# EAGLE design TM8_flash (EAGLE 9.6.2)
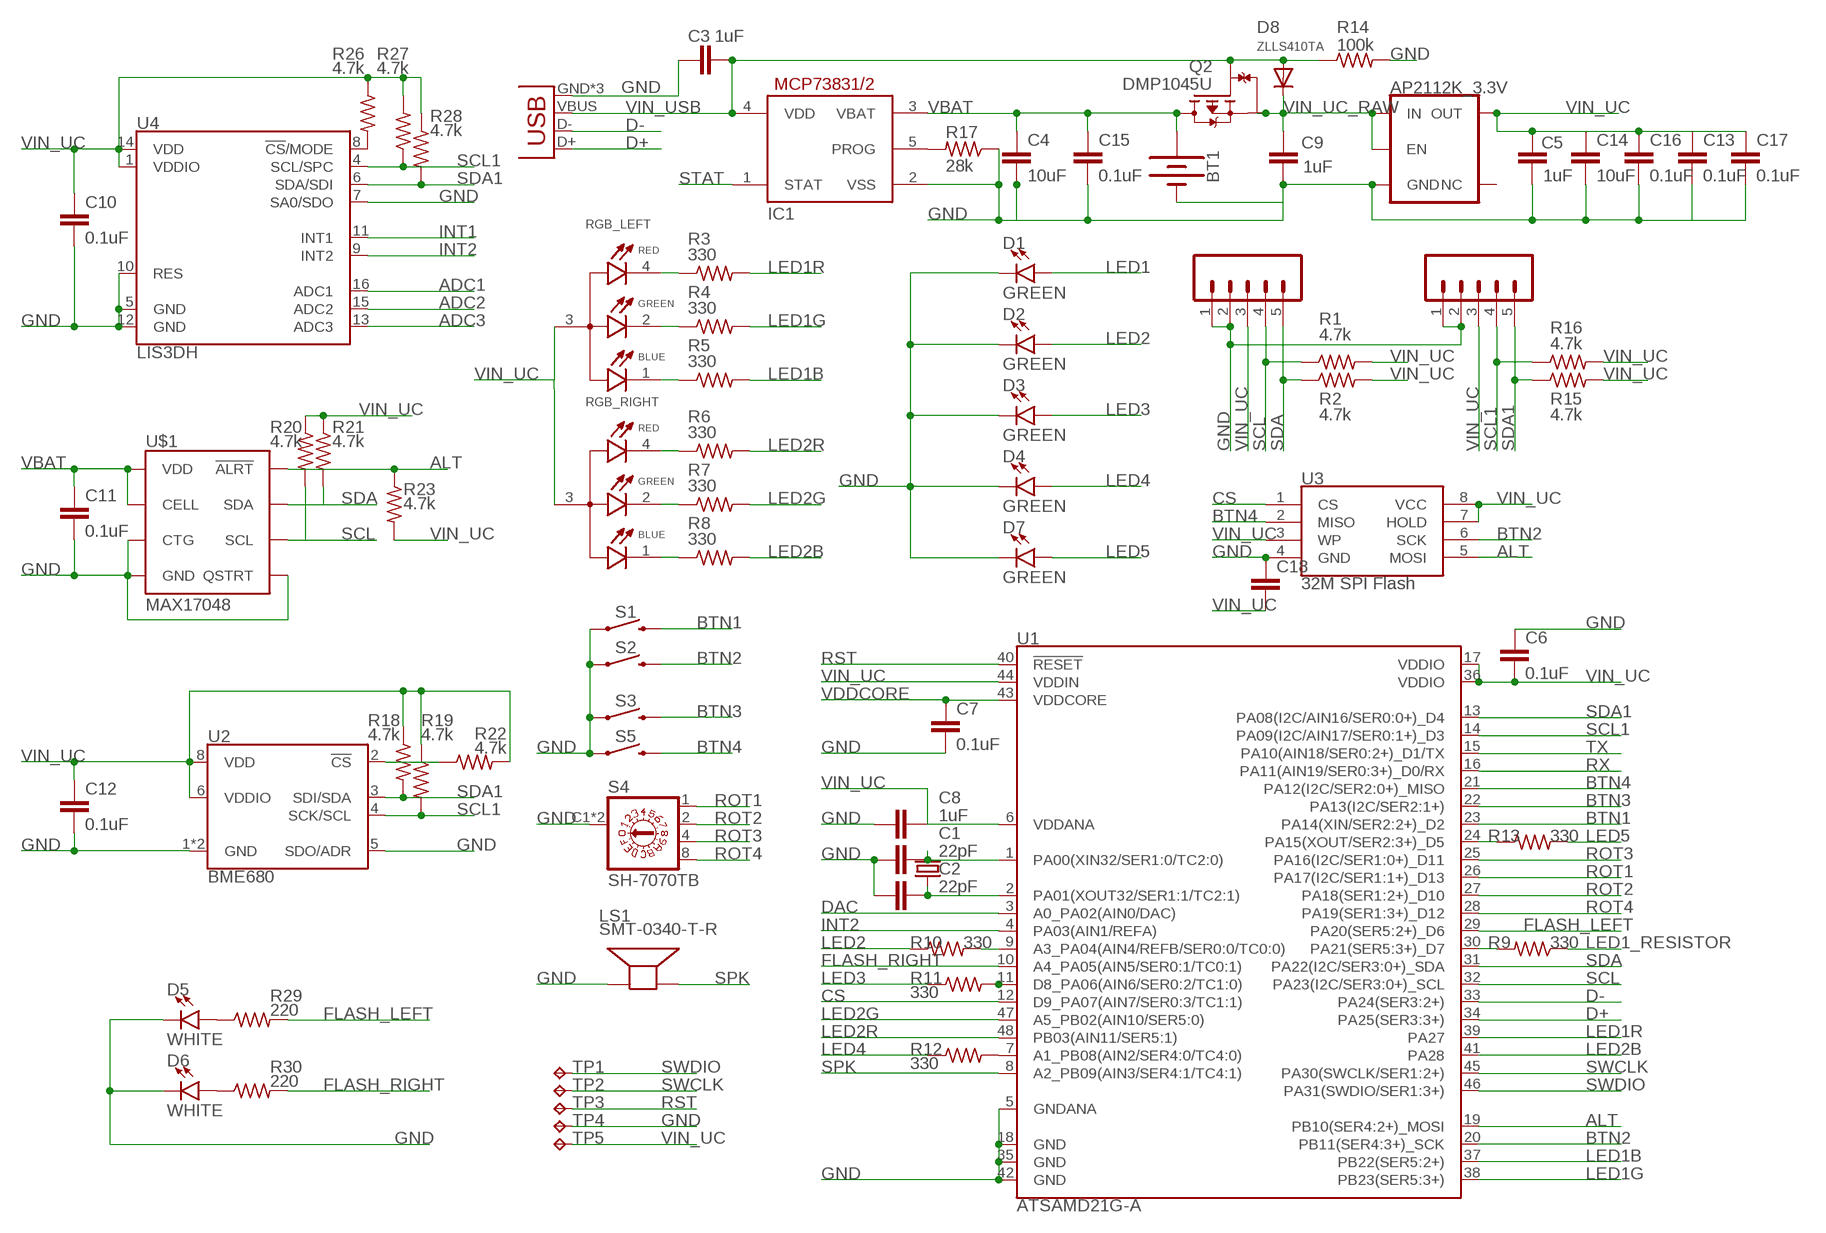
[diagram p0: schematic, sheet 1]

## Parts
AP2112K_3.3V  3.3V  V_REG_AP2112K-3.3V  [SOT23-5]
BT1  BATTERY-20MM_SMD_4LEGS_OVERPASTE_INNER  [BATTCON_20MM_4LEGS_OVERPASTE_INNER]
C1  22pF  C-EUC0402  [C0402]
C2  22pF  C-EUC0402  [C0402]
C3  1uF  C-EUC0402  [C0402]
C4  10uF  C-EUC0402  [C0402]
C5  1uF  C-EUC0402  [C0402]
C6  0.1uF  C-EUC0402  [C0402]
C7  0.1uF  C-EUC0402  [C0402]
C8  1uF  C-EUC0402  [C0402]
C9  1uF  C-EUC0402  [C0402]
C10  0.1uF  C-EUC0402  [C0402]
C11  0.1uF  C-EUC0402  [C0402]
C12  0.1uF  C-EUC0402  [C0402]
C13  0.1uF  C-EUC0402  [C0402]
C14  10uF  C-EUC0402  [C0402]
C15  0.1uF  C-EUC0402  [C0402]
C16  0.1uF  C-EUC0402  [C0402]
C17  0.1uF  C-EUC0402  [C0402]
C18  C-EUC0402  [C0402]
D1  GREEN  LED-GREEN1206  [LED-1206]
D2  GREEN  LED-GREEN1206  [LED-1206]
D3  GREEN  LED-GREEN1206  [LED-1206]
D4  GREEN  LED-GREEN1206  [LED-1206]
D5  WHITE  LED-WHITE1206  [LED-1206]
D6  WHITE  LED-WHITE1206  [LED-1206]
D7  GREEN  LED-GREEN1206  [LED-1206]
D8  ZLLS410TA  DIODESOD-323F  [SOD-323F]
IC1  MCP73831/OT  [SOT23-5L]
JP2  USB-MICROB  [USB-MICROB]
LCD1  CONN_05VERT_FEMALE_HEADER  [1X05_SMD_VERTICAL_COMBO]
LCD2  CONN_05VERT_FEMALE_HEADER  [1X05_SMD_VERTICAL_COMBO]
LS1  SMT-0340-T-R  [XDCR_SMT-0340-T-R]
Q2  DMP1045U  [SOT91P240X110-3N]
R1  4.7k  R-US_R0402  [R0402]
R2  4.7k  R-US_R0402  [R0402]
R3  330  R-US_R0402  [R0402]
R4  330  R-US_R0402  [R0402]
R5  330  R-US_R0402  [R0402]
R6  330  R-US_R0402  [R0402]
R7  330  R-US_R0402  [R0402]
R8  330  R-US_R0402  [R0402]
R9  330  R-US_R0402  [R0402]
R10  330  R-US_R0402  [R0402]
R11  330  R-US_R0402  [R0402]
R12  330  R-US_R0402  [R0402]
R13  330  R-US_R0402  [R0402]
R14  100k  R-US_R0402  [R0402]
R15  4.7k  R-US_R0402  [R0402]
R16  4.7k  R-US_R0402  [R0402]
R17  28k  R-US_R0402  [R0402]
R18  4.7k  R-US_R0402  [R0402]
R19  4.7k  R-US_R0402  [R0402]
R20  4.7k  R-US_R0402  [R0402]
R21  4.7k  R-US_R0402  [R0402]
R22  4.7k  R-US_R0402  [R0402]
R23  4.7k  R-US_R0402  [R0402]
R26  4.7k  R-US_R0402  [R0402]
R27  4.7k  R-US_R0402  [R0402]
R28  4.7k  R-US_R0402  [R0402]
R29  220  R-US_R0402  [R0402]
R30  220  R-US_R0402  [R0402]
RGB_LEFT  EAST1616RGBA3  [LED_EAST1616RGBA3]
RGB_RIGHT  EAST1616RGBA3  [LED_EAST1616RGBA3]
S1  MOMENTARY-SWITCH-SPST-SMD-6.0X3.5MM  [TACTILE_SWITCH_SMD_6.0X3.5MM]
S2  MOMENTARY-SWITCH-SPST-SMD-6.0X3.5MM  [TACTILE_SWITCH_SMD_6.0X3.5MM]
S3  MOMENTARY-SWITCH-SPST-SMD-6.0X3.5MM  [TACTILE_SWITCH_SMD_6.0X3.5MM]
S4  SH-7070TB  [SH-7070B]
S5  MOMENTARY-SWITCH-SPST-SMD-6.0X3.5MM  [TACTILE_SWITCH_SMD_6.0X3.5MM]
TP1  TPTP14R  [TP14R]
TP2  TPTP14R  [TP14R]
TP3  TPTP11R  [TP11R]
TP4  TPTP14R  [TP14R]
TP5  TPTP14R  [TP14R]
U1  ATSAMD21G-A  [TQFP-48]
U2  BME680  BME680-LGA  [LGA3.0X3.0]
U3  32M SPI Flash  SPI_FLASH-X25XXSMD  [SO08]
U4  LIS3DH  [LGA-16-3X3]
U$1  MAX17048  MAX17048DFN8  [DFN-8]
Y1  32.768kHz  CRYSTAL-32.768KHZSMD-3.2X1.5  [CRYSTAL-SMD-3.2X1.5MM]

## Nets
ADC1: U4.16(ADC1)
ADC2: U4.15(ADC2)
ADC3: U4.13(ADC3)
ALT: R23.1 U1.19(PB10(SER4:2+)_MOSI) U3.5(MOSI) U$1.P$5(!ALRT)
BTN1: S1.2 U1.23(PA14(XIN/SER2:2+)_D2)
BTN2: S2.2 U1.20(PB11(SER4:3+)_SCK) U3.6(SCK)
BTN3: S3.2 U1.22(PA13(I2C/SER2:1+))
BTN4: S5.2 U1.21(PA12(I2C/SER2:0+)_MISO) U3.2(MISO)
CS: U1.12(D9_PA07(AIN7/SER0:3/TC1:1)) U3.1(CS)
D+: JP2.D+ U1.34(PA25(SER3:3+))
D-: JP2.D- U1.33(PA24(SER3:2+))
DAC: U1.3(A0_PA02(AIN0/DAC))
FLASH_LEFT: R29.2 U1.29(PA20(SER5:2+)_D6)
FLASH_RIGHT: R30.2 U1.10(A4_PA05(AIN5/SER0:1/TC0:1))
GND: AP2112K_3.3V.2(GND) BT1.2(-) C1.1 C2.1 C3.1 C4.2 C5.2 C6.1 C7.2 C8.1 C9.2 C10.2 C11.2 C12.2 C13.2 C14.2 C15.2 C16.2 C17.2 C18.1 D1.C D2.C D3.C D4.C D5.C D6.C D7.C IC1.2(VSS) JP2.GND JP2.MT1(GND) JP2.MT2(GND) LCD1.1 LCD1.2 LCD2.1 LCD2.2 LS1.P R14.2 R17.1 S1.1 S2.1 S3.1 S4.C1(C) S4.C2(C) S5.1 TP4.TP U1.5(GNDANA) U1.18(GND) U1.35(GND) U1.42(GND) U2.1(GND) U2.5(SDO/ADR) U2.7(GND) U3.4(GND) U4.5(GND) U4.7(SA0/SDO) U4.10(RES) U4.12(GND) U$1.P$1(CTG) U$1.P$4(GND) U$1.P$6(QSTRT) U$1.P$9(GND)
INT1: U4.11(INT1)
INT2: U1.4(PA03(AIN1/REFA)) U4.9(INT2)
LED1: D1.A
LED1_RESISTOR: R9.1
LED1B: R5.2 U1.37(PB22(SER5:2+))
LED1G: R4.2 U1.38(PB23(SER5:3+))
LED1R: R3.2 U1.39(PA27)
LED2: D2.A R10.1
LED2B: R8.2 U1.41(PA28)
LED2G: R7.2 U1.47(A5_PB02(AIN10/SER5:0))
LED2R: R6.2 U1.48(PB03(AIN11/SER5:1))
LED3: D3.A R11.1
LED4: D4.A R12.1
LED5: D7.A R13.2
N$1: R12.2 U1.7(A1_PB08(AIN2/SER4:0/TC4:0))
N$2: R11.2 U1.11(D8_PA06(AIN6/SER0:2/TC1:0))
N$3: R9.2 U1.30(PA21(SER5:3+)_D7)
N$4: R10.2 U1.9(A3_PA04(AIN4/REFB/SER0:0/TC0:0))
N$5: R3.1 RGB_LEFT.4(R_C)
N$6: R4.1 RGB_LEFT.2(G_C)
N$7: R5.1 RGB_LEFT.1(B_C)
N$8: R6.1 RGB_RIGHT.4(R_C)
N$9: R7.1 RGB_RIGHT.2(G_C)
N$10: R8.1 RGB_RIGHT.1(B_C)
N$11: R13.1 U1.24(PA15(XOUT/SER2:3+)_D5)
N$13: IC1.5(PROG) R17.2
N$15: R22.1 U2.2(!CS)
N$16: D5.A R29.1
N$17: R26.2 U4.8(!CS!/MODE)
N$18: D6.A R30.1
ROT1: S4.1 U1.26(PA17(I2C/SER1:1+)_D13)
ROT2: S4.2 U1.27(PA18(SER1:2+)_D10)
ROT3: S4.4 U1.25(PA16(I2C/SER1:0+)_D11)
ROT4: S4.8 U1.28(PA19(SER1:3+)_D12)
RST: TP3.TP U1.40(!RESET!)
RX: U1.16(PA11(AIN19/SER0:3+)_D0/RX)
SCL: LCD1.4 R1.1 R20.2 U1.32(PA23(I2C/SER3:0+)_SCL) U$1.P$7(SCL)
SCL1: LCD2.4 R16.1 R19.2 R27.1 U1.14(PA09(I2C/AIN17/SER0:1+)_D3) U2.4(SCK/SCL) U4.4(SCL/SPC)
SDA: LCD1.5 R2.1 R21.2 U1.31(PA22(I2C/SER3:0+)_SDA) U$1.P$8(SDA)
SDA1: LCD2.5 R15.1 R18.2 R28.2 U1.13(PA08(I2C/AIN16/SER0:0+)_D4) U2.3(SDI/SDA) U4.6(SDA/SDI)
SPK: LS1.N U1.8(A2_PB09(AIN3/SER4:1/TC4:1))
STAT: IC1.1(STAT)
SWCLK: TP2.TP U1.45(PA30(SWCLK/SER1:2+))
SWDIO: TP1.TP U1.46(PA31(SWDIO/SER1:3+))
TX: U1.15(PA10(AIN18/SER0:2+)_D1/TX)
VBAT: BT1.1(+) C4.1 C11.1 C15.1 IC1.3(VBAT) Q2.3(D) U$1.P$2(CELL) U$1.P$3(VDD)
VDDCORE: C7.1 U1.43(VDDCORE)
VIN_UC: AP2112K_3.3V.5(OUT) C5.1 C6.2 C8.2 C10.1 C12.1 C13.1 C14.1 C16.1 C17.1 C18.2 LCD1.3 LCD2.3 R1.2 R2.2 R15.2 R16.2 R18.1 R19.1 R20.1 R21.1 R22.2 R23.2 R26.1 R27.2 R28.1 RGB_LEFT.3(A) RGB_RIGHT.3(A) TP5.TP U1.6(VDDANA) U1.17(VDDIO) U1.36(VDDIO) U1.44(VDDIN) U2.6(VDDIO) U2.8(VDD) U3.3(WP) U3.7(HOLD) U3.8(VCC) U4.1(VDDIO) U4.14(VDD)
VIN_UC_RAW: AP2112K_3.3V.1(IN) AP2112K_3.3V.3(EN) C9.1 D8.C Q2.2(S)
VIN_USB: C3.2 D8.A IC1.4(VDD) JP2.VBUS Q2.1(G) R14.1
XIN32: C1.2 U1.1(PA00(XIN32/SER1:0/TC2:0)) Y1.P$2
XOUT32: C2.2 U1.2(PA01(XOUT32/SER1:1/TC2:1)) Y1.P$1
Unconnected: AP2112K_3.3V.4(NC)

## Notes on the sheet
- D8 | R14
- C3
- R26 | R27
- R28
- C9 | C5
- R20 | R21
- R23
- R18 | R19
- R22
- R13
- R10 | R9
- R11
- R29
- R12
- R30

## Library data of the parts
AP2112K_3.3V = SparkFun-IC-Power:V_REG_AP2112: AP2112 - 600mA CMOS LDO Regulator w/ Enable The AP2112 is CMOS process low dropout linear regulator with enable function, the regulator delivers a guaranteed 600mA (min.) continuous load current. Features Output Voltage Accuracy: ±1.5% Output Current: 600mA (Min.) Foldback Short Current Protection: 50mA Enable Function to Turn ON/OFF VOUT Low Dropout Voltage (3.3V): 250mV (Typ.) @IOUT=600mA Excellent Load Regulation: 0.2%/A (Typ.) Excellent Line Regulation: 0.02%/V (Typ.) Low Quiescent Current: 55μA (Typ.) Low Standby Current: 0.01μA (Typ.) Low Output Noise: 50μVRMS PSRR: 100Hz -65dB, 1kHz -65dB OTSD Protection Stable with 1.0μF Flexible Cap: Ceramic, Tantalum and Aluminum Electrolytic Operation Temperature Range: -40°C to 85°C ESD: MM 400V, HBM 4000V; PROD_ID: VREG-12457
BT1 = SparkFun-Batteries:BATTERY: Battery - Single Cell A variety of battery chemistries, sizes, and footprints. Device List: 20MM_PTH - Coin Cell Battery Holder - 20mm (PTH) <https://www.sparkfun.com/products/783> 20MM_PTH_KIT- Coin Cell battery Holder - 20 mm (PTH) <http://www.sparkfun.com/products/783>kit version with special mask 6.8MM_PTH - Coin Cell Battery Holder - 6.8MM(SMD) <https://www.digikey.com/product-detail/en/seiko-instruments/MS621FE-FL11E/728-1057-ND/1889208?WT.srch=1&gclid=CNOQ5a6LzdQCFZS2wAodXCkE0g> 12MM_SMD - Coin Cell Battery Holder - 12mm (SMD) <https://www.sparkfun.com/products/10592> 12MM_PTH - Coin Cell Battery Holder - 12mm (PTH) <https://www.sparkfun.com/products/7948> 20MM_SMD - 20mm Coin Cell Battery Holder (SMD) (2 legs) Used on the Big Time Watch Kit <https://www.sparkfun.com/products/11734> 20MM_SMD_4LEGS - Coin Cell Battery Holder - 20mm (SMD) <https://www.sparkfun.com/products/11892> 20MM_SMD_4LEGS_OVERPASTE - Coin Cell Battery Holder - 20mm (SMD) <https://www.sparkfun.com/products/11892> (Over-paste on the legs) 24.5MM_PTH - Coin Cell Battery Holder - 24.5mm (PTH) <https://www.sparkfun.com/products/8863> 9V - 9V Battery Holder - PC Mount Used on the SparkFun SparkPunk Sound Kit <https://www.sparkfun.com/products/11177> and SparkFun SparkPunk Sequencer Kit <https://www.sparkfun.com/products/12707> 18650 - Battery Holder - 18650 (PTH) <https://www.sparkfun.com/products/13113> AA - Battery Holder - 1xAA (PTH) <https://www.sparkfun.com/products/7949> AAA - Battery Holder - 1xAAA (PTH) <https://www.sparkfun.com/products/12718> AA_KIT - Battery Holder - 1xAA (PTH) <https://www.sparkfun.com/products/7949> Special kit package - pads only have exposed copper on one side of the board. AAA_KIT - Battery Holder - 1xAAA (PTH) <https://www.sparkfun.com/products/12718> Special kit package - pads only have exposed copper on one side of the board.
C1-C18 = rcl:C-EU: CAPACITOR, European symbol; SPICEPREFIX: C
D1-D4 D7 = SparkFun-LED:LED-GREEN: Green SMD LED Used in manufacturing of various products at SparkFun Packages: 0603 - SMD 0603 package [Product Link] <http://www.futureelectronics.com/en/technologies/semiconductors/optoelectronics/leds/Pages/9894312-LTST-C190GKT.aspx?CrossPart=HSMG-C190&IM=0> LilyPad 1206 - SMD1206 LilyPad package [Product Link] <http://www.futureelectronics.com/en/Technologies/Product.aspx?ProductID=IN150NGHARVATEKCORPORATION2049943&IM=0> 1206 - SMD1206 package [Product Link] <http://www.futureelectronics.com/en/technologies/semiconductors/optoelectronics/leds/Pages/8315665-LTST-C150KGKT.aspx?IM=0> 1206 Bottom Mount -SMD 1206 Bottom Mount [Product Link] <http://www.digikey.com/product-detail/en/lite-on-inc/LTST-C230KGKT/160-1456-1-ND/386854> SparkFun Products: Pro Mini 328 -5V <https://www.sparkfun.com/products/821> RedBoard <https://www.sparkfun.com/products/12757> MP3 Trigger <https://www.sparkfun.com/products/13720> Makey Makey <https://www.sparkfun.com/products/11076>; PROD_ID: DIO-00862
D5 D6 = SparkFun-LED:LED-WHITE: White SMD LED Used in manufacturing several products at SparkFun. Packages: 0603 - Bright White SMD 0603 package[Product Link] <http://www.kingbrightusa.com/product.asp?catalog_name=LED&product_id=APT1608QWF/D> 1206 - Bright White SMD1206 package [Product Link] <http://www.kingbrightusa.com/product.asp?catalog_name=LED&product_id=APT3216QWF/D> 3014 - Super Bright SMD 3014 package [Datasheet] <http://www.lumileds.com/uploads/459/DS208-pdf> SparkFun Products: Blackberry Trackballer Breakout <https://www.sparkfun.com/products/13169> Digital SandBox <https://www.sparkfun.com/products/12651>; PROD_ID: DIO-09955
D8 = adafruit:DIODE: Diode SMADIODE - SMA Surface Mount Package 20V 1A Schottky Diode Digikey: 641-1014-6-ND DO-1N4148 - Through Hole Small Current Diode SOD-123 20V 1 A (.5mV Vf) Schottky Diode - Digikey: MBRX120TPMSCT-ND SOD-323 10V 570mA (.38mV Vf, 3ns) Schottky Diode - Digikey: ZLLS410CT-ND SOD-523 30V 30mA Schottky Diode (RB751S-40TE61) - Digikey: RB751S-40TE61CT-ND SOT23-R/W - SOT23 Package (R = Solder Paste/Reflow Ovens, W = Hand-Soldering) BAT54Film 40V 300mA - Digikey: 497-7162-1-ND
IC1 = adafruit:MCP73831: MCP73831/2 Miniature Single-Cell, Fully Integrated Li-Ion, Li-Polymer Charge Management Controllers. Nice and small simple lipoly charge controller, with adjustable current and status output (LED) http://www.ladyada.net/library/pcb/eaglelibrary.html
JP2 = Feesta-parts:USB: USB Connectors USB-B-PTH is fully proven SKU : PRT-00139/CONN-08278 USB-miniB is fully proven SKU : PRT-00587 USB-A-PCB is untested. USB-A-H is throughly reviewed, but untested. Spark Fun Electronics SKU : PRT-00437 USB-B-SMT is throughly reviewed, but untested. Needs silkscreen touching up. USB-A-S has not been used/tested USB-MB-H has not been used/tested USB-MICROB has been used. CONN-09505; PROD_ID: CONN-09505
LCD1 LCD2 = SparkFun-Connectors:CONN_05: Multi connection point. Often used as Generic Header-pin footprint for 0.1 inch spaced/style header connections On any of the 0.1 inch spaced packages, you can populate with these: Break Away Headers - Straight <https://www.sparkfun.com/products/116> (PRT-00116) Break Away Male Headers - Right Angle <https://www.sparkfun.com/products/553> (PRT-00553) Female Headers <https://www.sparkfun.com/products/115> (PRT-00115) Break Away Headers - Machine Pin <https://www.sparkfun.com/products/117> (PRT-00117) Break Away Female Headers - Swiss Machine Pin <https://www.sparkfun.com/products/743> (PRT-00743) For SCREWTERMINALS and SPRING TERMINALS visit here: Screw Terimnals on SparkFun.com <https://www.sparkfun.com/search/results?term=Screw+Terminals> (5mm/3.5mm/2.54mm spacing) This device is also useful as a general connection point to wire up your design to another part of your project. Our various solder wires solder well into these plated through hole pads. Hook-Up Wire - Assortment (Stranded, 22 AWG) <https://www.sparkfun.com/products/11375> (PRT-11375) Hook-Up Wire - Assortment (Solid Core, 22 AWG) <https://www.sparkfun.com/products/11367> (PRT-11367) View the entire wire category on our website here <https://www.sparkfun.com/categories/141> Special notes: Molex polarized connector foot print use with SKU : PRT-08231 with associated crimp pins and housings. 1MM SMD Version SKU: PRT-10208; PROD_ID: CONN-15262
LS1 = SMT-0340-T-R:SMT-0340-T-R; MANUFACTURER: Pui Audio; MAXIMUM_PACKAGE_HEIGHT: 2.00 mm; PARTREV: 3/10/2020; STANDARD: Manufacturer Recomemndations
Q2 = DMP1045U:DMP1045U: P-Channel 12V 4A (Ta) 800mW (Ta) Surface Mount SOT-23 Check availability <https://pricing.snapeda.com/parts/DMP1045U/Diodes%20Inc./view-part?ref=eda>; AVAILABILITY: In Stock; DESCRIPTION: P-Channel 12 V 2.6A (Ta) 530mW Surface Mount X2-WLB0808-4 (Type C); MF: Diodes Inc.; MP: DMP1045U; PACKAGE: SOT-23 Diodes Inc.; PRICE: None; PURCHASE-URL: https://pricing.snapeda.com/search/part/DMP1045U/?ref=eda
R1-R13 R15 R16 R18-R23 R26-R30 = rcl:R-US_: RESISTOR, American symbol; SPICEPREFIX: R
R14 R17 = adafruit:R-US_: RESISTOR, American symbol
RGB_LEFT RGB_RIGHT = EAST1616RGBA3:EAST1616RGBA3: Red, Green, Blue (RGB) LED Indication - Discrete 1.95V Red, 2.8V Green, 2.8V Blue 0606 (1616 Metric) Check availability <https://pricing.snapeda.com/parts/EAST1616RGBA3/Everlight%20Electronics/view-part?ref=eda>; AVAILABILITY: In Stock; DESCRIPTION: Red, Green, Blue (RGB) - LED Indication - Discrete 1.95V Red, 2.8V Green, 2.8V Blue 0606 (1616 Metric); MF: Everlight Electronics; MP: EAST1616RGBA3; PACKAGE: 0606 Everlight; PRICE: None; PURCHASE-URL: https://pricing.snapeda.com/search/part/EAST1616RGBA3/?ref=eda
S1-S3 S5 = SparkFun-Switches:MOMENTARY-SWITCH-SPST: Momentary Switch (Pushbutton) - SPST Normally-open (NO) SPST momentary switches (buttons, pushbuttons). Variants PTH-12MM - 12mm square, through-hole Momentary Pushbutton Switch - 12mm Square <https://www.sparkfun.com/products/9190> (COM-09190) PTH-6.0MM, PTH-6.0MM-KIT - 6.0mm square, through-hole Mini Pushbutton Switch <https://www.sparkfun.com/products/97> (COM-00097) KIT package intended for soldering kit's - only one side of pads' copper is exposed. PTH-RIGHT-ANGLE-KIT - Right-angle, through-hole Right Angle Tactile Button <https://www.sparkfun.com/products/10791> - Used on SparkFun BigTime Watch Kit <https://www.sparkfun.com/products/11734> SMD-12MM - 12mm square, surface-mount Tactile Button - SMD (12mm) <https://www.sparkfun.com/products/12993> (COM-12993) Used on SparkFun PicoBoard <https://www.sparkfun.com/products/11888> SMD-4.5MM - 4.5mm Square Trackball Switch Used on SparkFun Blackberry Trackballer Breakout <https://www.sparkfun.com/products/13169> SMD-4.6MMX2.8MM - 4.60mm x 2.80mm, surface mount Used on SparkFun Pro Micro - RP2040 <https://www.sparkfun.com/products/17717> SMD-5.2MM, SMD-5.2-REDUNDANT - 5.2mm square, surface-mount Mini Pushbutton Switch - SMD <https://www.sparkfun.com/products/8720> (COM-08720) Used on Arduino Pro Mini <https://www.sparkfun.com/products/11114> REDUNDANT package connects both switch circuits together SMD-6.0X3.5MM - 6.0 x 3.5mm, surface mount Momentary Reset Switch SMD <https://www.sparkfun.com/products/8229> (COM-08229) SMD-6.2MM-TALL - 6.2mm square, surface mount Tactile Button - SMD (6mm) <https://www.sparkfun.com/products/12992> Used on SparkFun Digital Sandbox <https://www.sparkfun.com/products/12651> SMD-RIGHT-ANGLE - Right-angle, surface mount Used on SparkFun Block for Intel® Edison - Arduino <https://www.sparkfun.com/products/13036>; PROD_ID: SWCH-14278; SF_SKU: COM-08229
S4 = SH-7070TB:SH-7070TB: ROTARY CODED HEX SWITCH Check availability <https://pricing.snapeda.com/parts/SH-7070TB/Nidec%20Copal/view-part?ref=eda>; AVAILABILITY: In Stock; DESCRIPTION: Dip Switch Hexadecimal Complement 16 Position Surface Mount Rotary for Tool Actuator 100mA 5VDC; MF: Nidec Copal; MP: SH-7070TB; PACKAGE: None; PRICE: None; PURCHASE-URL: https://pricing.snapeda.com/search/part/SH-7070TB/?ref=eda
TP1-TP5 = testpad:TP: Test pad
U1 = SparkFun-IC-Microcontroller:ATSAMD21G: Atmel SAMD21G SMART ARM-Based Microcontroller The Atmel ® | SMART ™ SAM D21 is a series of low-power microcontrollers using the 32-bit ARM ® Cortex ® -M0+ processor, and ranging from 32- to 64-pins with up to 256KB Flash and 32KB of SRAM. The SAM D21 devices operate at a maximum frequency of 48MHz and reach 2.46 CoreMark/MHz. They are designed for simple and intuitive migration with identical peripheral modules, hex compatible code, identical linear address map and pin compatible migration paths between all devices in the product series. All devices include intelligent and flexible peripherals, Atmel Event System for inter-peripheral signaling, and support for capacitive touch button, slider and wheel user interfaces. Datasheet <https://cdn.sparkfun.com/datasheets/Dev/Arduino/Boards/Atmel-42181-SAM-D21_Datasheet.pdf> SparkFun Products SparkFun SAMD21 Mini Breakout <https://www.sparkfun.com/products/13664> (DEV-13664) SparkFun SAMD21 Dev Breakout <https://www.sparkfun.com/products/13672> (DEV-13672) (DEV-14926); PROD_ID: IC-13064
U2 = SparkFun-Sensors:BME680: Bosch BME680 – Combined Humidity and Pressure Sensor The BME680 is as combined digital humidity, pressure and temperature sensor based on proven sensing principles. The sensor module is housed in an extremely compact metal-lid LGA package with a footprint of only 3.0×3.0mm with a height of 0.93mm. Its small dimensions and its low power consumption allow the implementation in battery driven devices such as handsets, GPS modules or watches.; PROD_ID: IC-14656
U3 = SparkFun-IC-Memory:SPI_FLASH-X25XX: 32M Serial Flash Memory 8pin SPI Flash series x25xx. Works with devices like W25X32 and BR25L32 Datasheet <http://www.macronix.com/Lists/Datasheet/Attachments/5031/MX25L3206E,%203V,%2032Mb,%20v1.5.pdf> SparkFun Products SparkFun Venus GPS Logger <https://www.sparkfun.com/products/10920> (GPS-10920); PROD_ID: N/A
U4 = SparkFun-Sensors:LIS3DH: ST Microelectronics LIS3DH 3-Axis ±2/4/8/16g SPI/I2C Accelerometer The LIS3DH is a three axis MEMS linear accelerometer in the "nano" family. It has a digital I2C/SPI serial interface which makes it ideal for using in embedded applications. The device also features ultra low-power operational modes that allow advanced power saving and smart sleep to wake-up functions, built in detections with interrupts, and auxiliary ADC inputs Datasheet-XXXX <http://www.sparkfun.com/datasheets/Sensors/Accelerometer/LIS3DH.pdf> SparkFun Products SparkFun Triple Axis Accelerometer Breakout - LIS3DH <https://www.sparkfun.com/products/10345> (SEN-XXXXX) Triple Axis Accelerometer - LIS3DH <https://www.sparkfun.com/products/9755> (SEN-XXXXX); PROD_ID: IC-13419; SF_ID: N/A
U$1 = SparkFun-IC-Power:MAX17048: Micropower 1-Cell Li+ ModelGauge SparkFun Products Qduino Mini <https://www.sparkfun.com/products/13614> (DEV-13614); PROD_ID: IC-12551
Y1 = SparkFun-Clocks:CRYSTAL-32.768KHZ: 32.768kHz Crystal Frequency: 32.768kHz Frequency Stability: ±20ppm Load Capacitance: 12.5pF (PTH-2X6 & SMD-3.2X1.5), 6pF (SMD-2X6) SparkFun Products: SparkFun BigTime Watch Kit <https://www.sparkfun.com/products/11734> SparkFun nRF52832 Breakout <https://www.sparkfun.com/products/13990> SparkFun Real Time Clock Module <https://www.sparkfun.com/products/12708>; PROD_ID: XTAL-13062

## Board
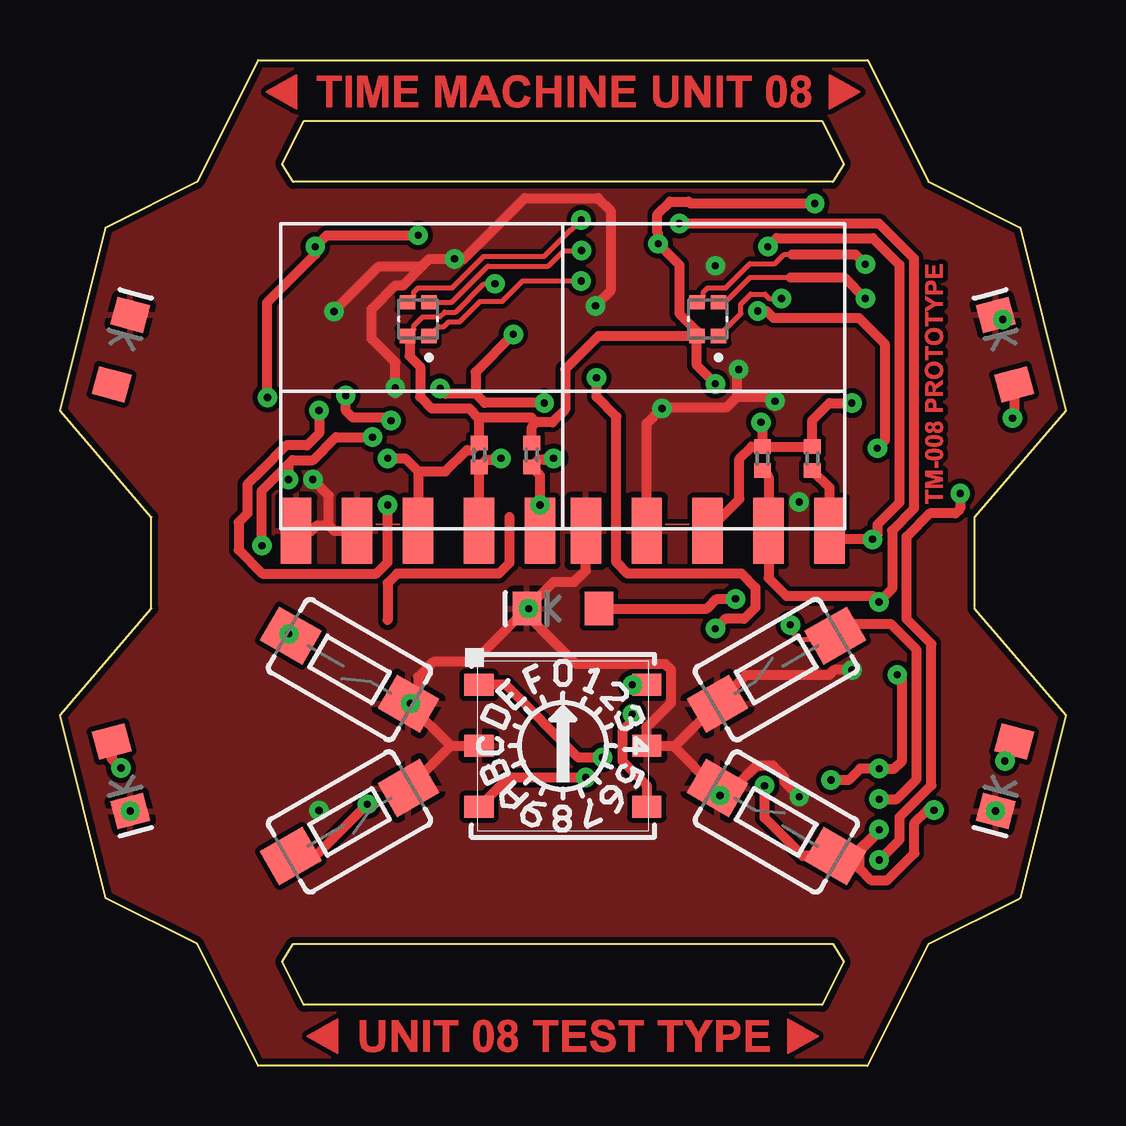
[diagram p1: board, top side]
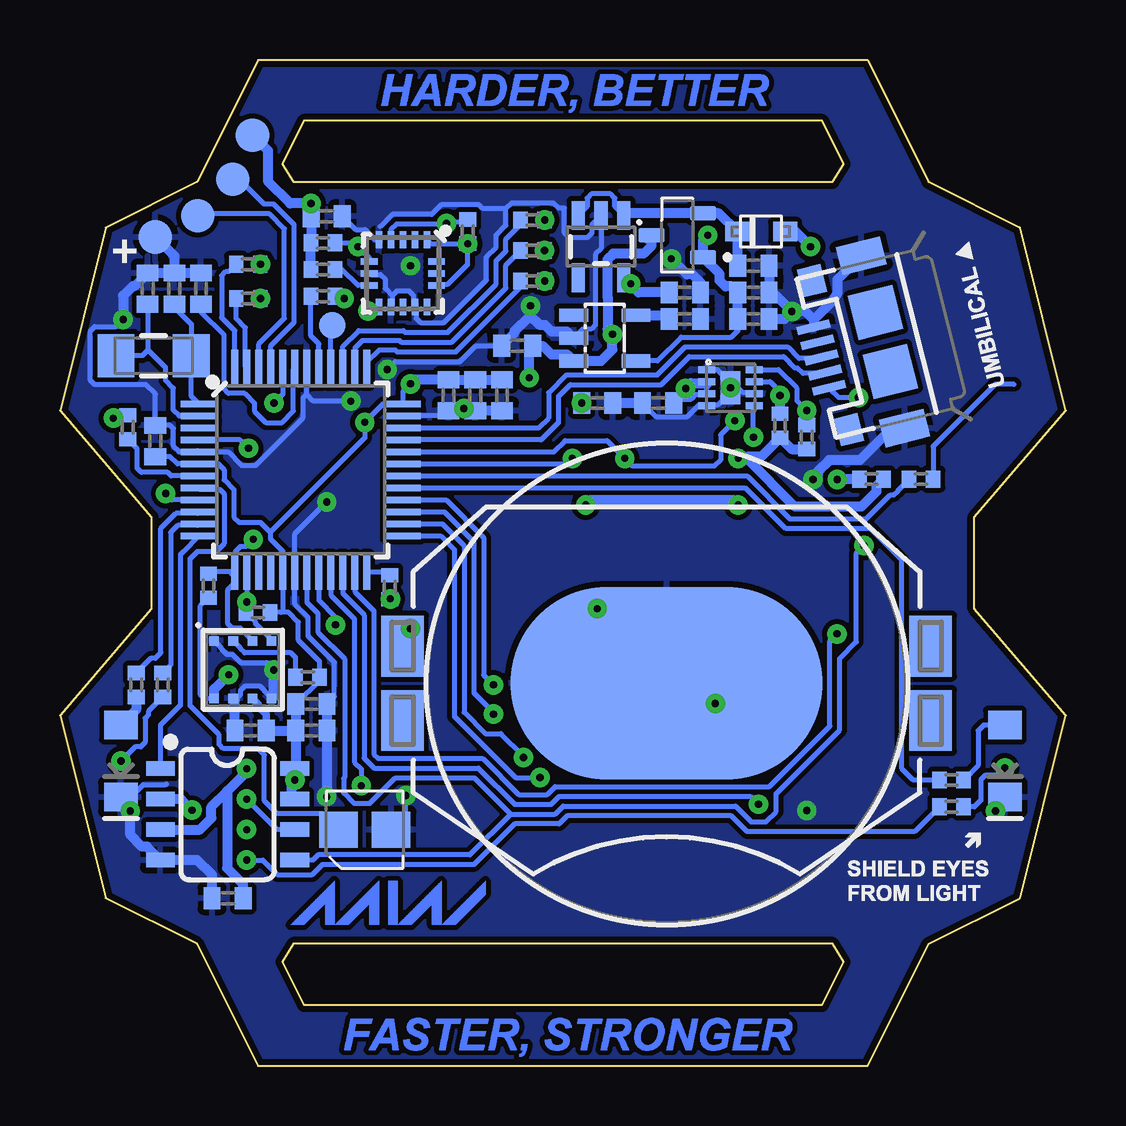
[diagram p2: board, bottom side, seen from below]

Size 41.91 x 41.91 mm. Coordinates in mm from the lower left corner, seen from the top.
Outline: 33.66,0 8.25,0 5.71,5.08 1.9,6.99 0,14.6 3.81,19.05 3.81,22.86 0,27.3 1.9,34.92 5.71,36.83 8.25,41.91 33.66,41.91 36.2,36.83 40,34.92 41.91,27.3 38.1,22.86 38.1,19.05 41.91,14.6 40,6.99 36.2,5.08 33.66,0
Outline: 31.75,39.37 32.65,37.57 32.19,36.83 9.72,36.83 9.26,37.57 10.16,39.37 31.75,39.37
Outline: 10.16,2.54 9.26,4.34 9.72,5.08 32.19,5.08 32.65,4.34 31.75,2.54 10.16,2.54
Copper layers (1*16): Top 0.035mm / dielectric 1.5mm / Bottom 0.035mm
Design rules "SparkFun *": minimum track width 6mil, minimum drill 0.29971875mm, track to track 8mil, track to pad 8mil, pad to pad 8mil, via to via 8mil, smd to smd 8mil, copper to edge 10mil, drill to drill 8mil, minimum pad ring 12mil, minimum via ring 10mil, stop-mask expansion 4mil, vias tented up to drill 25mil, thermal gap 10mil

### Footprints (pad centres in the part's own frame; a part is rotated, then mirrored left to right if it is on the bottom)
SOT23-5 = smd 0.55 x 1.2: 1 -0.95,-1.3; 2 0,-1.3; 3 0.95,-1.3; 4 0.95,1.3; 5 -0.95,1.3
BATTCON_20MM_4LEGS_OVERPASTE_INNER = smd 1.778 x 2.54: 1 -11,1.55; 3 11,1.55; P$1 -11,-1.55; P$2 11,-1.55 | smd 13 x 8: 2 0,0
C0402 = smd 0.7 x 0.9: 1 -0.65,0; 2 0.65,0
LED-1206 = smd 1.2 x 1.4: A -1.5,0; C 1.5,0
SOD-323F = smd 1 x 0.8: A -1,0; C 1,0
SOT23-5L = smd 0.55 x 1.2: 1 -0.95,-1.3; 2 0,-1.3; 3 0.95,-1.3; 4 0.95,1.3; 5 -0.95,1.3
USB-MICROB = smd 0.35 x 1.4: D+ 0,2.65; D- -0.65,2.65; GND 1.3,2.65; ID 0.65,2.65; VBUS -1.3,2.65 | smd 1.2 x 1.9: MT1 -3.7,0; MT2 3.7,0 | smd 1.9 x 1.9: P$1 -1.27,0; P$2 1.27,0 | smd 1.2 x 1: P$3 -3.2,2.25; P$4 3.2,2.25
1X05_SMD_VERTICAL_COMBO = smd 1.27 x 2.75: 1 0,1.65; 2 2.54,1.65; 3 5.08,1.65; 4 7.62,1.652; 5 10.16,1.65
XDCR_SMT-0340-T-R = smd 1.5 x 1.6: N 0,1.1; P 0,-1.1
SOT91P240X110-3N = smd 1.09 x 0.61: 1 -1.07,0.915; 2 -1.07,-0.915; 3 1.07,0
R0402 = smd 0.6 x 0.7: 1 -0.5,0; 2 0.5,0
R0402' = smd 0.7 x 0.9: 1 -0.65,0; 2 0.65,0
LED_EAST1616RGBA3 = smd 0.6 x 0.65: 1 0.7,0.45; 2 -0.7,0.45; 3 0.7,-0.45; 4 -0.7,-0.45
TACTILE_SWITCH_SMD_6.0X3.5MM = smd 2.032 x 1.626: 1 -2.833,0; 2 2.833,0
SH-7070B = smd 1.219 x 0.914: 1 -2.223,3.81; 2 4.763,-1.27; 4 -2.223,-1.27; 8 4.763,3.81; C1 -2.223,1.27; C2 4.763,1.27
TP14R = smd 1.4 x 1.4: TP 0,0
TP11R = smd 1.1 x 1.1: TP 0,0
TQFP-48 = smd 1.5 x 0.28: 1 -4.25,2.75; 2 -4.25,2.25; 3 -4.25,1.75; 4 -4.25,1.25; 5 -4.25,0.75; 6 -4.25,0.25; 7 -4.25,-0.25; 8 -4.25,-0.75; 9 -4.25,-1.25; 10 -4.25,-1.75; 11 -4.25,-2.25; 12 -4.25,-2.75; 25 4.25,-2.75; 26 4.25,-2.25; 27 4.25,-1.75; 28 4.25,-1.25; 29 4.25,-0.75; 30 4.25,-0.25; 31 4.25,0.25; 32 4.25,0.75; 33 4.25,1.25; 34 4.25,1.75; 35 4.25,2.25; 36 4.25,2.75 | smd 0.28 x 1.5: 13 -2.75,-4.25; 14 -2.25,-4.25; 15 -1.75,-4.25; 16 -1.25,-4.25; 17 -0.75,-4.25; 18 -0.25,-4.25; 19 0.25,-4.25; 20 0.75,-4.25; 21 1.25,-4.25; 22 1.75,-4.25; 23 2.25,-4.25; 24 2.75,-4.25; 37 2.75,4.25; 38 2.25,4.25; 39 1.75,4.25; 40 1.25,4.25; 41 0.75,4.25; 42 0.25,4.25; 43 -0.25,4.25; 44 -0.75,4.25; 45 -1.25,4.25; 46 -1.75,4.25; 47 -2.25,4.25; 48 -2.75,4.25
LGA3.0X3.0 = smd 0.4 x 0.4: 1 1.2,1.2; 2 1.2,0.4; 3 1.2,-0.4; 4 1.2,-1.2; 5 -1.2,-1.2; 6 -1.2,-0.4; 7 -1.2,0.4; 8 -1.2,1.2
SO08 = smd 0.6 x 1.2: 1 -1.905,-2.8; 2 -0.635,-2.8; 3 0.635,-2.8; 4 1.905,-2.8; 5 1.905,2.8; 6 0.635,2.8; 7 -0.635,2.8; 8 -1.905,2.8
LGA-16-3X3 = smd 0.7 x 0.28: 1 -1.4,1; 2 -1.4,0.5; 3 -1.4,0; 4 -1.4,-0.5; 5 -1.4,-1; 9 1.4,-1; 10 1.4,-0.5; 11 1.4,0; 12 1.4,0.5; 13 1.4,1 | smd 0.28 x 0.7: 6 -0.5,-1.4; 7 0,-1.4; 8 0.5,-1.4; 14 0.5,1.4; 15 0,1.4; 16 -0.5,1.4
DFN-8 = smd 0.3 x 0.7: P$1 -0.75,-0.99; P$2 -0.25,-0.99; P$3 0.25,-0.99; P$4 0.75,-0.99; P$5 0.75,0.99; P$6 0.25,0.99; P$7 -0.25,0.99; P$8 -0.75,0.99 | smd 1.38 x 0.8: P$9 0,0
CRYSTAL-SMD-3.2X1.5MM = smd 1.524 x 1.8: P$1 -1.567,0; P$2 1.567,0

### Placement (x,y rotation side)
AP2112K_3.3V  19.37,34.13 180 bottom
BT1  16.64,15.94 0 bottom
C1  37.15,32.38 270 bottom
C2  38.26,32.38 270 bottom
C3  13.02,31.11 180 bottom
C4  22.86,30 180 bottom
C5  15.88,32.23 0 bottom
C6  25.72,27.94 90 bottom
C7  36.04,32.38 90 bottom
C8  31.43,15.08 180 bottom
C9  13.02,33.34 0 bottom
C10  30.8,35.4 0 bottom
C11  16.99,27.62 180 bottom
C12  31.43,13.97 0 bottom
C13  33.97,13.97 180 bottom
C14  23.49,27.94 270 bottom
C15  19.53,27.62 0 bottom
C16  24.61,27.94 270 bottom
C17  37.94,26.03 90 bottom
C18  34.92,6.99 0 bottom
D1  2.54,29.84 75 top
D2  2.54,12.06 285 top
D3  39.37,12.06 255 top
D4  39.37,29.84 105 top
D5  2.54,12.7 270 bottom
D6  39.37,12.7 270 bottom
D7  20.95,19.05 180 top
D8  12.7,34.77 180 bottom
IC1  19.21,30.32 270 bottom
JP2  7.62,30.16 104.1 bottom
LCD1  9.84,20.64 0 top
LCD2  21.91,20.64 0 top
LS1  29.21,9.84 90 bottom
Q2  16.19,34.61 180 bottom
R1  17.47,25.45 90 top
R2  19.66,25.45 90 top
R3  22.23,35.24 180 bottom
R4  22.23,33.97 180 bottom
R5  22.23,32.7 180 bottom
R6  34.07,33.4 180 bottom
R7  34.07,31.97 180 bottom
R8  30.96,32.07 180 bottom
R9  6.03,24.45 180 bottom
R10  4.76,10.79 180 bottom
R11  37.62,15.87 90 bottom
R12  39.08,26.61 270 bottom
R13  28.17,19.94 270 bottom
R14  100k  [R0402']  13.02,32.23 0 bottom
R15  31.35,25.3 90 top
R16  29.27,25.3 90 top
R17  28k  [R0402']  15.88,31.11 180 bottom
R18  35.72,20 90 bottom
R19  33.66,18.89 180 bottom
R20  11.91,26.67 90 bottom
R21  10.8,26.19 90 bottom
R22  31.59,16.19 0 bottom
R23  8.1,24.45 0 bottom
R26  30.96,33.18 0 bottom
R27  24.92,34.77 270 bottom
R28  30.96,34.29 0 bottom
R29  4.76,11.91 180 bottom
R30  38.73,15.87 90 bottom
RGB_LEFT  14.92,31.11 270 top
RGB_RIGHT  26.99,31.11 270 top
S1  12.06,16.51 150 top
S2  29.84,16.51 30 top
S3  12.06,10.16 210 top
S4  19.68,12.06 0 top
S5  29.84,10.16 330 top
TP1  36.16,35.42 26.5 bottom
TP2  34.71,36.94 206.5 bottom
TP3  30.57,30.87 180 bottom
TP4  37.93,34.53 26.5 bottom
TP5  33.89,38.77 26.5 bottom
U1  31.88,24.83 0 bottom
U2  34.29,16.51 90 bottom
U3  34.92,10.48 270 bottom
U4  27.62,33.02 270 bottom
U$1  13.97,28.26 270 bottom
Y1  38.01,29.59 0 bottom

### Tracks (layer width: path | path; a pad name or v marks a point on that pad's centre or on a via)
ALT  (via drill 0.3)
  Top 0.406: v9.52,24.43 9.52,25.08 | v8.41,21.67 8.41,23.97 9.52,25.08 | 9.52,25.08 9.68,25.24 10.55,25.24 11.5,26.19 v13.02,26.19
  Bottom 0.203: 31.59,20.62 U1.19 31.63,19.32 31.16,18.85 31.16,18.07 30.05,16.95 30.05,12.02 30.09,11.98 30.09,11.37 29.66,10.94 29,10.94 27.94,12 24.64,12 23.13,10.49 | v13.02,26.19 13.02,27.3 12.98,27.34 U$1.P$5 | v8.41,21.67 8.72,21.36 8.72,17.66 9.43,16.96 9.43,13.99 12.07,11.34 12.07,10.6 12.5,10.17 13.11,10.17 13.76,10.82 20.95,10.82 21.28,10.49 23.13,10.49 | 23.13,10.49 24.83,8.79 31.15,8.79 31.37,8.57 U3.5
  Bottom 0.406: R23.1 9.51,24.45 v9.52,24.43
BTN1  (via drill 0.3)
  Top 0.203: v9.54,18 S1.2
  Bottom 0.203: v9.54,18 9.83,17.71 9.83,14.15 12.35,11.63 21.28,11.63 21.61,11.3 22.79,11.3 24.3,12.81 28.65,12.81 28.83,12.99 28.83,18.96 29.63,19.76 U1.23
BTN2  (via drill 0.3)
  Top 0.203: v30.43,18.38 30.43,18.15 30.8,17.78 32.15,17.78 S2.2
  Top 0.406: 32.77,18.4 S2.2 32.79,18.41 34.61,18.41 35.7,17.33 35.7,11.94 34.86,11.11 v34.13,11.11
  Bottom 0.203: U1.20 31.13,19.39 30.43,18.7 v30.43,18.38 | U3.6 32.15,9.87 32.88,9.87 v34.13,11.11
BTN3  (via drill 0.3)
  Top 0.406: 9.61,9.14 S3.2 10.65,8.74 v12.8,10.9
  Bottom 0.203: U1.22 30.13,19.68 29.24,18.79 29.24,12.82 28.82,12.41 24.47,12.41 22.96,10.9 21.45,10.9 21.11,11.23 13.13,11.23 v12.8,10.9
BTN4  (via drill 0.3)
  Top 0.406: v29.36,11.67 29.36,10.33 30.94,8.74 S5.2 33.03,8.74 v34.13,9.84 34.13,9.75 33.3,8.92 33.3,8.23 33.78,7.74 34.48,7.74 35.6,8.86 35.6,10.12 36.13,10.65 v36.41,10.65
  Bottom 0.203: U1.21 30.63,19.61 29.64,18.62 29.64,12.66 29.36,12.37 v29.36,11.67
  Bottom 0.406: v36.41,10.65 36.87,11.11 U3.2
CS
  Bottom 0.203: U1.12 36.8,21.4 | 36.8,21.4 36.89,21.31 | 36.8,21.4 36.8,21.39 36.89,21.3 36.89,15.02 37.72,14.19 U3.1
D+
  Bottom 0.203: U1.34 21.96,26.58 21.55,26.99 21.55,28.05 20.81,28.79 17.02,28.79 15.86,29.95 11.59,29.95 11.12,29.48 10.51,29.48 10.47,29.52 JP2.D+
D-
  Bottom 0.203: U1.33 21.86,26.08 21.15,26.79 21.15,27.88 20.64,28.38 16.85,28.38 15.69,29.55 11.76,29.55 11.29,29.07 11.19,29.07 10.96,28.85 10.35,28.85 10.31,28.89 JP2.D-
FLASH_LEFT
  Bottom 0.203: U1.29 13.36,24.08 11.66,22.38 8.12,22.38 6.83,21.09 6.83,12.39 6.35,11.91 R29.2
FLASH_RIGHT
  Bottom 0.203: U1.10 36.18,23.02 37.08,23.02 37.71,22.39 37.71,17.21 37.94,16.98 38.13,16.98 R30.2 38.73,16.5
GND  (via drill 0.3)
  Top 0.203: 21.91,21.5 LCD2.1 | 26.73,11.58 27.3,11.58 S5.1 27.5,11.47 | 27.39,14.92 S2.1 | S1.1 v14.6,15.09 | 27.66,11.31 27.5,11.47 | v27.5,11.27 27.5,11.47
  Top 0.406: LCD2.2 24.45,26.76 v25.08,27.39 25.14,27.45 27.78,27.45 28.22,27.88 | v28.28,29.01 28.22,28.95 28.22,27.88 | 3.09,31.29 D1.C | 12.1,22 LCD1.2 | 16.28,13.33 S1.1 14.92,15.5 14.92,16.19 15.56,16.83 17.23,16.83 19.33,18.93 | 16.28,13.33 S4.C1 | S3.1 16.28,13.33 | 25.55,13.33 S4.C2 24.45,14.11 25.46,15.12 25.46,16.5 25.23,16.74 21.52,16.74 19.33,18.93 | 25.55,13.33 27.3,11.58 | 25.55,13.33 25.63,13.33 S2.1 28.58,16.28 32.04,16.28 32.26,16.5 v33,16.5 | 19.33,18.93 D7.C 20.57,20.16 21.43,20.16 21.91,20.64 LCD2.1 | LCD1.1 10.47,22.29 10.7,22.52 11.21,22.52 | 11.21,22.52 11.44,22.29 LCD1.2 | LCD1.2 12.38,23.16 | 15.08,33.31 13.29,33.31 v11.41,31.43 | 15.08,33.31 14.29,32.52 13.98,32.52 12.99,31.53 12.99,30.29 13.97,29.31 U$1.P$9 13.97,28.01 | 15.08,33.31 15.4,33.63 v16.44,33.63 16.84,33.63 19.37,36.16 22.41,36.16 22.95,35.62 22.95,32.3 v22.31,31.67 | v39.28,31.1 39.18,31.1 D4.C | 11.21,22.52 11.21,23.76 v10.54,24.43 | 28.22,27.88 29.61,27.88 v29.79,27.7 | v30.8,11.22 30.19,11.82 30.19,12.02 29.7,12.51 29.01,12.51 28.08,11.58 S5.1
  Bottom 0.203: BT1.2 15.79,15.09 v14.6,15.09 | v28.28,29.01 27.95,29.34 25.25,29.34 24.58,30 C4.2 | C6.1 25.93,27.08 U1.35 | 28.07,32.1 27.89,32.27 27.36,32.27 27.18,32.1 27.18,31.67 U4.12 27.07,31.56 27.07,31.14 26.89,30.96 25.92,30.96 24.14,32.74 24.14,33.7 23.74,34.11 23.74,34.62 23.33,35.02 23.33,35.72 | 28.07,32.1 28.07,31.67 U4.10 | U4.7 28.97,32.96 28.55,32.96 28.37,32.79 28.37,32.4 28.07,32.1 | D5.C 2.54,11 | TP4.TP 38.26,34.21 | 38.98,10.81 D3.C 39.37,11 D6.C 38.97,11.2 38.45,11.72 37.5,11.72 37.47,11.75 | U$1.P$4 14.91,27.55 14.48,27.55 14.3,27.73 14.3,27.92 U$1.P$9 | 17.64,27.53 C11.2 17.04,27.03 15.8,27.03 15.32,27.51 U$1.P$4 | U$1.P$4 15.22,27.51 | U$1.P$6 13.02,28.05 13.46,28.05 13.66,28.26 U$1.P$9 | C12.2 30.78,13.63 | C8.1 30.48,15.38 30.48,16.81 31.57,17.9 31.57,18.69 32.13,19.24 U1.18 32.13,22.17 v30.8,23.49 | U$1.P$9 14.3,28.59 14.3,28.78 14.53,29.01 U$1.P$1 | U1.5 36.18,25.63 | U1.5 36.95,25.58 37.18,25.81 37.18,26.55 37.32,26.68 C17.2 37.94,28 38.33,28.39 40.46,28.39 40.64,28.56 40.64,30.62 40.46,30.8 39.58,30.8 v39.28,31.1 | IC1.2 20.14,30.69 19.78,30.69 19.6,30.87 19.6,31.67 19.61,31.67 19.61,33.81 19.37,34.05 AP2112K_3.3V.2 19.74,35.06 19.74,34.7 19.92,34.53 20.72,34.53 20.9,34.7 20.9,35.73 21.14,35.73 21.35,35.95 23.1,35.95 23.33,35.72 | 23.33,35.72 24.3,35.72 24.45,35.87 26.03,35.87 26.42,35.48 28.06,35.48 28.57,34.97 | C10.2 29.59,34.84 29.2,34.84 28.78,34.42 U4.5 | v29.79,27.7 31.35,27.7 31.63,27.98 | 31.63,27.98 U1.42 | 31.63,27.98 31.78,27.83 31.78,27.01 33.76,25.02 34.35,25.02 34.91,25.58 U1.5 | LS1.P 27.5,10.45 v27.5,11.27 | U2.1 35.2,17.41 35.2,17.38 34.96,17.14 34.73,17.14 34.38,16.8 33.3,16.8 v33,16.5
  Bottom 0.203: 34.62,15.24 34.39,15.47 34.39,15.64 34.22,15.81 33.56,15.81 33.38,15.64 33.38,15.6 U2.5
  Bottom 0.406: C9.2 R14.2 12.21,32.23 v11.41,31.43 | JP2.MT2 9.52,32.76 9.52,32.19 9.69,31.91 10.51,31.09 | D5.C 2.93,10.81 D2.C | TP4.TP 37.15,33.75 C1.1 | C7.2 C1.1 | C1.1 C2.1 38.8,32.49 38.88,32.49 39.28,32.09 v39.28,31.1 | 10.51,31.09 JP2.GND | 10.51,31.09 10.85,31.43 v11.41,31.43 | JP2.MT1 7.25,26.57 8.58,25.24 9.86,25.24 10.34,24.77 10.34,24.63 v10.54,24.43 | C15.2 C11.2 | v11.41,31.43 11.73,31.11 C3.1 | C14.2 C16.2 24.71,27.39 v25.08,27.39 25.18,27.29 C6.1 | C5.2 15.23,32.65 15.56,32.98 15.79,32.98 v16.44,33.63 | IC1.2 20.78,30.59 21.42,30.59 21.69,30.86 21.91,30.86 22.31,31.26 | 22.31,31.26 v22.31,31.67 | C4.2 22.97,30.55 22.97,30.62 22.73,30.86 22.71,30.86 22.31,31.26 | 34.69,14.04 C13.2 34.62,15.24 U2.7 | U2.5 33,15.4 v33,16.5 | D3.C 38.98,9.62 38.49,9.14 38.29,9.14 U3.4 36.2,8.57 35.57,7.95 C18.1 | C8.1 C12.2 30.8,13.95 v30.8,11.22
  other vias: 19.53,19.05 38.98,10.62 2.93,10.62 13.97,28.26 10.8,10.64 27.3,33.34
  pour Top: -1.27,43.18 43.18,43.18 43.18,-1.27 -1.27,-1.27
  pour Bottom: -1.27,43.18 43.18,43.18 43.18,-1.27 -1.27,-1.27
INT2  (via drill 0.3)
  Top 0.406: v34.06,25.73 34.36,26.04 34.36,30.09 33.29,31.16 29.73,31.16 29.44,31.45 v29.07,31.45
  Bottom 0.203: U4.9 28.9,31.62 v29.07,31.45 | v34.06,25.73 34.4,26.08 U1.4
LED1_RESISTOR
  Bottom 0.203: 2.15,28.4 2.95,28.4 5.53,25.81 R9.1
LED1B
  Bottom 0.203: R5.2 22.73,32.43 25.41,29.75 27.86,29.75 27.94,29.82 28.61,29.82 29.13,29.31 U1.37
LED1G
  Bottom 0.203: R4.2 23.33,33.37 23.33,32.41 25.58,30.15 27.69,30.15 27.77,30.23 29.3,30.23 29.61,29.92 29.63,29.9 U1.38
LED1R
  Bottom 0.203: U1.39 30.13,29.98 29.47,30.64 27.6,30.64 27.52,30.56 25.75,30.56 23.74,32.57 23.74,33.54 23.33,33.94 23.33,34.45 22.73,35.05 R3.2
LED2  (via drill 0.3)
  Top 0.406: D2.A 2.15,12.79 v2.54,12.41
  Bottom 0.203: v2.54,12.41 2.84,12.1 3.37,12.1 3.54,11.93 3.54,11.06 3.81,10.79 R10.1
LED2B
  Bottom 0.203: U1.41 31.13,30.08 31.46,30.41 R8.2
LED2G
  Bottom 0.203: 34.57,31.71 R7.2 34.57,31.15 34.18,30.76 34.18,29.13 U1.47
LED2R
  Bottom 0.203: R6.2 34.86,33.1 34.99,33.1 35.17,32.92 35.17,31.18 34.63,30.63 U1.48
LED3  (via drill 0.3)
  Top 0.406: D3.A 39.76,13.09 v39.37,12.7
  Bottom 0.203: 37.8,15.2 R11.1 38.23,14.77 38.23,14.62 38.36,14.49 38.36,13.47 38.54,13.29 38.77,13.29 v39.37,12.7
LED4  (via drill 0.3)
  Top 0.406: D4.A 39.76,27.06 v39.69,26.99
  Bottom 0.203: R12.1 39.2,26.99 v39.69,26.99
LED5  (via drill 0.3)
  Top 0.406: v28.14,19.46 27.37,19.46 26.96,19.05 D7.A
  Bottom 0.406: v28.14,19.46 28.16,19.46 R13.2
LIGHTNING_2
  Top 0.406: 18.73,22.86 18.73,20.95 18.28,20.51 14.05,20.51 13.65,20.11 13.65,18.57
N$1
  Bottom 0.152: U1.7
  Bottom 0.203: U1.7 37.28,24.58 37.43,24.73 38.52,24.73 38.7,24.91 38.7,25.72 R12.2
N$2
  Bottom 0.203: U1.11 36.18,22.52 37,22.52 37.3,22.23 37.3,16.7 R11.2
N$3
  Bottom 0.203: R9.2 6.99,23.99 6.99,23.97 7.17,23.79 7.31,23.79 8.31,22.79 11.5,22.79 13.28,24.58 U1.30
N$4  (via drill 0.3)
  Top 0.406: v37.51,23.84 37.51,23.22 37.3,23.02 36.24,23.02 35.28,22.05 35.28,18.61 36.3,17.58 36.3,11.69 34.99,10.37 34.99,9.43 v34.13,8.57
  Bottom 0.203: U1.9 37.24,23.58 v37.51,23.84 | v34.13,8.57 33.46,8.57 32.85,7.97 31.4,7.97 30.98,8.38 24.66,8.38 22.96,10.08 21.11,10.08 20.78,10.41 13.93,10.41 13.28,9.76 6.3,9.76 R10.2
N$5  (via drill 0.3)
  Top 0.203: v21.71,35.24 21.31,34.84 21.28,34.84 20.17,33.73 17.66,33.73 16.35,32.42 14.92,32.42 14.74,32.24 14.74,32.09 RGB_LEFT.4
  Bottom 0.203: v21.71,35.24 R3.1
N$6  (via drill 0.3)
  Top 0.203: RGB_LEFT.2 16.32,31.81 17.82,33.32 20.34,33.32 21,33.97 R4.1
  other vias: 21.73,33.97
N$7  (via drill 0.3)
  Top 0.203: RGB_LEFT.1 15.76,30.8 15.99,30.8 16.19,31 16.65,31 17.5,31.85 18.43,31.85 19.28,32.7 v21.71,32.7
  Bottom 0.203: v21.71,32.7 R5.1
N$8  (via drill 0.3)
  Top 0.203: RGB_RIGHT.4 26.81,32.09 26.81,32.24 26.99,32.42 27.75,32.42 28.75,33.42 29.79,33.42 30.18,33.81 30.5,33.81
  Top 0.406: v33.56,33.4 33.14,33.81 30.5,33.81
  Bottom 0.203: v33.56,33.4 R6.1
N$9  (via drill 0.3)
  Top 0.203: RGB_RIGHT.2 27.72,31.81 28.76,32.85 30.43,32.85
  Top 0.406: 30.43,32.85 32.67,32.85 v33.56,31.97
  Bottom 0.203: v33.56,31.97 R7.1
N$10  (via drill 0.3)
  Top 0.203: RGB_RIGHT.1 28.37,31.34 28.37,31.74 28.78,32.16 29.37,32.16 29.55,31.97 v30.06,31.97
  Bottom 0.203: v30.06,31.97 30.16,32.07 R8.1
N$11
  Bottom 0.203: U1.24 28.3,20.58 R13.1
N$13
  Bottom 0.406: IC1.5 16.68,31.27 R17.2
N$15
  Bottom 0.203: R22.1 32.09,17.01 32.29,17.2 34.22,17.2 34.39,17.38 34.39,17.41 U2.2
N$16
  Bottom 0.203: D5.A 3.42,14.2 3.65,13.97 3.65,12.52 R29.1
N$17
  Bottom 0.203: U4.8 29.5,32.52 30.16,33.18 R26.2
N$18
  Bottom 0.406: R30.1 38.73,14.83 D6.A
ROT1  (via drill 0.3)
  Top 0.406: S4.1 18.57,15.87 21.6,12.85 v22.6,12.85
  Bottom 0.203: U1.26 25.97,22.58 25.07,21.67 25.07,14.73 24.18,13.84 23.55,13.84 22.6,12.89 v22.6,12.85
ROT2  (via drill 0.3)
  Top 0.406: v23.85,14.66 23.85,14.38 23.43,13.96 23.43,12.71 24.45,11.69 S4.2
  Bottom 0.203: v23.85,14.66 23.85,14.73 24.66,15.54 24.66,21.84 25.9,23.08 U1.27
ROT3  (via drill 0.3)
  Top 0.406: v21.91,12.01 18.68,12.01 S4.4
  Bottom 0.203: 27.61,22.07 U1.25 26.05,22.08 25.47,21.5 25.47,14.56 22.93,12.01 v21.91,12.01
ROT4  (via drill 0.3)
  Top 0.203: v23.85,15.87 S4.8
  Bottom 0.203: U1.28 25.82,23.58 24.25,22.01 24.25,16.28 v23.85,15.87
RST
  Bottom 0.203: U1.40 30.63,30.81 TP3.TP
SCL  (via drill 0.3)
  Top 0.406: v13.79,26.88 13.67,27 12.21,27 11.91,27.3 v11.91,27.93 | LCD1.4 R1.1 17.77,25.24 17.99,25.24 18.06,25.31 v18.38,25.31
  Bottom 0.203: U$1.P$7 12.32,28.51 11.91,28.09 v11.91,27.93 | U1.32 21.33,25.58 20.87,26.05 19.11,26.05 v18.38,25.31 18.05,24.98 14.64,24.98 14.39,25.24 14.39,26.29 v13.79,26.88
  Bottom 0.406: R20.2 v11.91,27.93
SCL1  (via drill 0.3)
  Top 0.203: 29.43,22.54 29.43,22.39 LCD2.4
  Top 0.406: 29.56,22.54 29.43,22.54 29.27,22.54 | R16.1 29.53,24.54 LCD2.4 | v25.8,35.1 34.12,35.1 35.58,33.64 35.58,23.21 34.67,22.3 34.67,19.87 v34.13,19.33 33.88,19.57 30.27,19.57 29.53,20.32 LCD2.4 | 29.53,22.09 LCD2.4 | LCD2.4 29.53,22.24
  Bottom 0.203: 25.11,35.07 25.02,35.17 | 25.02,35.17 R27.1 | 25.02,35.17 25.73,35.17 v25.8,35.1 25.83,35.07 27.89,35.07 28.12,34.84 U4.4 | R19.2 33.76,18.5 33.76,18.41 33.09,17.74 U2.4 | U1.14 v34.13,19.33
  Bottom 0.406: R19.2 34.16,19.3 v34.13,19.33
SDA  (via drill 0.3)
  Top 0.406: R2.1 19.68,24.92 | LCD1.5 19.87,22.42 20,22.55 v20,23.37 20,24.6 R2.1 | v13.65,23.37 v13.66,23.37 13.66,20.98 13.19,20.51 8.44,20.51 7.45,21.5 7.45,22.65 7.8,23 7.8,24.22 8.38,24.8 | v10.8,27.3 10.8,26.35 10.29,25.85 9.43,25.85 8.38,24.8 | v20.56,25.31 20.24,25.31 20.17,25.24 19.95,25.24 R2.1 | 8.38,24.8
  Bottom 0.203: U$1.P$8 11.98,29.01 11.2,28.22 11.2,27.71 v10.8,27.3 10.87,27.38 | U1.31 20.8,25.08 v20.56,25.31
  Bottom 0.406: v20,23.37 19.8,23.57 13.85,23.57 v13.65,23.37 | v10.8,27.3 R21.2
SDA1  (via drill 0.3)
  Top 0.203: 32.23,22.29 LCD2.5
  Top 0.406: 32.07,22.7 LCD2.5 32.42,21.94 v33.86,21.94 34.06,22.14 34.06,22.55 34.97,23.47 34.97,33.39 33.87,34.49 29.85,34.49 v29.49,34.13 | R15.1 32.07,24.09 32.07,22.7 | 32.36,23 32.07,22.7
  Bottom 0.203: U4.6 29.02,33.66 v29.49,34.13 29.65,34.29 R28.2 | U1.13 34.63,21.4 34.39,21.63 34.16,21.63 v33.86,21.94 | U1.13 34.7,20.5 34.77,20.5 34.76,20.5 | U1.13 35.64,20.58 R18.2 | U1.13 34.63,20.13 34.92,19.84 34.92,18.41 34.74,18.24 34.38,18.24 33.89,17.74 U2.3
SPK
  Bottom 0.203: U1.8 36.07,24.02 35.25,24.02 35.07,23.84 35.07,21.75 35.4,21.42 36.2,21.42 36.49,21.13 36.49,15 35.28,13.79 35.28,13.39 35.1,13.21 33.66,13.21 33.4,12.96 33.4,11.05 32.85,10.51 30.98,10.51 LS1.N
SWCLK
  Bottom 0.203: U1.45 33.13,30 | 33.13,30 33.13,30.01 | 33.13,30 32.16,30.97 32.16,35.05 33.01,35.9 33.4,35.9 34.44,36.94 TP2.TP
SWDIO
  Bottom 0.203: U1.46 33.63,30.08 33.3,30.41 33.29,30.41 32.56,31.14 32.56,34.88 33.18,35.5 36.08,35.5 TP1.TP
VBAT  (via drill 0.3)
  Top 0.406: v22.36,28.67 22.36,27.88 23.18,27.05 23.18,20.97 23.64,20.51 28.4,20.51 28.98,19.92 28.98,19.09 28.5,18.62 27.71,18.62 v27.31,18.21 | C15.1 17.69,27.62 17.32,28 | v18.89,30.48 17.32,28.91 17.32,28 | 17.32,28 16.06,28 v15.84,28.22
  Bottom 0.203: 17.49,34.38 Q2.3 | U$1.P$2 14.96,28.42 U$1.P$3 15,27.96 15.44,27.96 15.62,27.78 16.18,27.78 C11.1 16.34,27.73
  Bottom 0.406: Q2.3 17.26,34.17 17.6,33.84 18.86,33.84 19.1,33.6 19.1,32.04 19.1,30.68 v18.89,30.48 18.89,29.84 19.36,29.37 IC1.3 20.78,29.64 21.44,29.64 21.8,30 C4.1 22.36,29.86 v22.36,28.67 | v27.31,18.21 27.31,18.1 27.3,18.1 27.3,17.82 BT1.1 | v15.84,28.22 15.61,28.45 14.99,28.45 14.96,28.42
  other vias: 20.18,27.62
VDDCORE
  Bottom 0.203: C7.1 36.04,31.42 35.07,30.45 35.07,28.2 34.89,28.02 34.21,28.02 33.81,27.62 33.81,27.28 33.33,26.8 32.66,26.8 32.18,27.28 32.18,29.02 U1.43
VIN_UC  (via drill 0.3)
  Top 0.203: RGB_LEFT.3 14.57,30.51 14.74,30.68 14.74,30.84 15.11,31.21 15.82,31.21 16.02,31.41 16.49,31.41 17.66,32.59 v18.13,32.59
  Top 0.406: RGB_RIGHT.3 26.54,30.61 25.81,31.35 25.81,33.37 v24.92,34.25 24.92,34.69 24.89,34.72 24.89,35.48 25.43,36.01 26.18,36.01 26.26,35.93 v31.45,35.93 | v27.3,28.42 26.54,29.18 RGB_RIGHT.3 | LCD2.3 28.31,23.61 28.31,25.29 28.82,25.8 R16.2 | R16.2 R15.2 | v29.21,26.81 29.27,26.75 R16.2 | R15.2 31.35,26.91 32.06,27.62 v32.99,27.62 | R15.2 31.42,25.8 31.43,25.82 | 14.57,30.51 14.57,29.57 15,29.14 15,27.88 15.49,27.39 17.06,27.39 17.44,27.01 | RGB_RIGHT.3 22.44,30.41 21.05,29.02 21.05,27.34 20.51,26.81 19.84,26.81 | 19.84,26.81 19.64,27.01 17.44,27.01 | R2.2 19.66,26.63 19.84,26.81 | 17.44,27.01 17.47,26.98 R1.2 17.18,25.66 16.95,25.66 16.06,24.77 14.92,24.77 | 31.39,25.76 R15.2 | 14.92,24.77 LCD1.3 | v13.65,25.31 14.38,25.31 14.92,24.77 | 35.09,16.1 v34.88,16.3 35.08,16.1 35.08,12.7 34.77,12.38 v34.13,12.38 33.34,12.38 32.86,11.91 v32.12,11.91
  Bottom 0.152: U2.6 | U2.8
  Bottom 0.203: 31.61,34.44 R28.1 31.59,34.42 | v24.92,34.25 R27.2 | U4.14 26.17,32.57 25.75,32.57 24.92,33.4 v24.92,34.25 | U4.1 26.46,34.25 v24.92,34.25 | v27.3,28.42 27.63,28.09 U1.36 28.45,27.58 v29.21,26.82 v29.21,26.81 29.21,26.17 33.15,22.23 | U1.44 32.63,27.98 v32.99,27.62 | 32.08,13.93 C12.1 | C8.2 31.09,16.07 R22.2 31.09,16.85 31.98,17.73 31.98,18.48 32.38,18.89 32.7,18.89 | U2.8 35.91,15.31 36.08,15.49 36.08,19.14 R18.1 | C17.1 37.33,25.38 37.02,25.08 U1.6 35.31,25.08 35.07,24.84 35.07,24.42 34.67,24.01 34.67,22.86 34.45,22.64 33.56,22.64 33.15,22.23 | 32.7,18.89 R19.1 | 32.7,18.89 32.63,18.97 U1.17 32.63,21.43 33.15,21.95 33.15,22.23 | C13.1
  Bottom 0.305: U2.6 33.65,15.07 33.65,14.96 33.32,14.64 C13.1
  Bottom 0.406: 7.69,24.54 R23.2 7.89,24.15 7.89,23.93 8.52,23.3 11.28,23.3 13.3,25.31 | R26.1 R28.1 31.45,34.3 C10.1 v31.45,35.93 32.32,35.93 33.25,36.86 33.25,38.14 TP5.TP | v27.3,28.42 27.13,28.59 C6.2 C16.1 C14.1 | AP2112K_3.3V.5 18.17,32.59 | 18.17,32.59 v18.13,32.59 | C5.1 17.81,32.23 18.17,32.59 | R20.1 | R20.1 11.43,25.69 R21.1 | C8.2 C12.1 | 32.12,13.97 32.08,13.93 32.12,13.89 | 13.3,25.31 v13.65,25.31 | 13.3,25.31 13.23,25.38 12.68,25.38 12.21,25.86 12.21,25.87 R20.1 | 34.7,16.3 v34.88,16.3 35.49,15.69 U2.8 | C13.1 C12.1 | U3.7 32.28,11.27 32.28,11.75 v32.12,11.91 U3.8 32.08,12.42 C12.1 | C18.2 34.27,7.57 34.94,8.24 34.94,11.45 | v34.13,12.38 34.13,12.26 34.94,11.45 | 34.94,11.45 35.6,10.79 35.6,10.32 36.08,9.84 U3.3
VIN_UC_RAW
  Bottom 0.203: 18.42,35.72 AP2112K_3.3V.1 18.79,35.8 18.79,36.16 18.97,36.34 19.77,36.34 19.95,36.16 19.95,35.8 AP2112K_3.3V.3 | 18.42,35.72 18.42,35.78 | 18.3,35.84 18.42,35.72
  Bottom 0.406: C9.1 13.67,34.73 D8.C 14.46,35.52 Q2.2 18.33,35.52 AP2112K_3.3V.1
VIN_USB  (via drill 0.3)
  Top 0.406: v8.64,27.85 8.64,31.82 10.64,33.81 v10.64,34.13 11.11,34.61 v14.92,34.61
  Bottom 0.203: 13.68,31.9 R14.1 13.67,32.19 | JP2.VBUS 9.47,27.85 v8.64,27.85 | 13.84,31.11 C3.2 13.67,30.62 13.93,30.36 16.03,30.36 17.02,29.37 IC1.4
  Bottom 0.406: C3.2 R14.1 13.92,32.48 14.19,32.48 14.42,32.72 14.42,32.99 Q2.1 15.12,34.41 v14.92,34.61 | v10.64,34.13 11.27,34.77 D8.A
XIN32
  Bottom 0.203: U1.1 36.44,27.89 Y1.P$2 36.44,30.91 37.15,31.61 C1.2
XOUT32
  Bottom 0.203: 39.46,29.59 Y1.P$1 38.48,29.59 38.26,29.81 38.26,29.84 | C2.2 38.26,29.84 | 38.26,29.84 37.51,29.09 37.51,28.56 37.18,28.24 37.18,27.31 36.95,27.08 U1.2
(copper drawn outside any net)
  shapes: Bottom area x6176, Top area x8362

### Text on the board
bPlace: +